# EAGLE design PowerOut_Top (EAGLE 9.3.0)
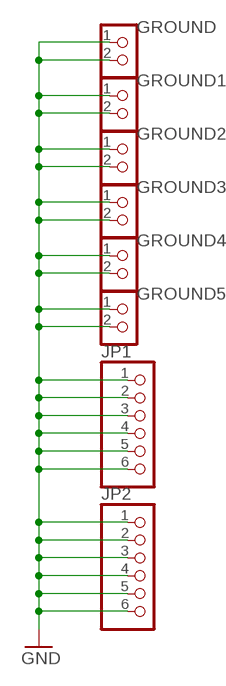
[diagram p0: schematic, sheet 1]

## Parts
GROUND  CON_TERMINAL_BLOCK_02-5MM  [TERMINAL_BLOCK_2P_5]
GROUND1  CON_TERMINAL_BLOCK_02-5MM  [TERMINAL_BLOCK_2P_5]
GROUND2  CON_TERMINAL_BLOCK_02-5MM  [TERMINAL_BLOCK_2P_5]
GROUND3  CON_TERMINAL_BLOCK_02-5MM  [TERMINAL_BLOCK_2P_5]
GROUND4  CON_TERMINAL_BLOCK_02-5MM  [TERMINAL_BLOCK_2P_5]
GROUND5  CON_TERMINAL_BLOCK_02-5MM  [TERMINAL_BLOCK_2P_5]
JP1  PINHD-1X6  [1X06]
JP2  PINHD-1X6  [1X06]

## Nets
GND [LARGE]: GROUND1.1 GROUND1.2 GROUND2.1 GROUND2.2 GROUND3.1 GROUND3.2 GROUND4.1 GROUND4.2 GROUND5.1 GROUND5.2 GROUND.1 GROUND.2 JP1.1 JP1.2 JP1.3 JP1.4 JP1.5 JP1.6 JP2.1 JP2.2 JP2.3 JP2.4 JP2.5 JP2.6

## Library data of the parts
GROUND GROUND1-GROUND5 = dp_devices:CON_TERMINAL_BLOCK_02: 2 poles wire to board terminal block
JP1 JP2 = adafruit:PINHD-1X6: PIN HEADER

## Net classes
0 default: width 0.61 mm, clearance 0.305 mm
1 LARGE: width 1.8 mm

## Board
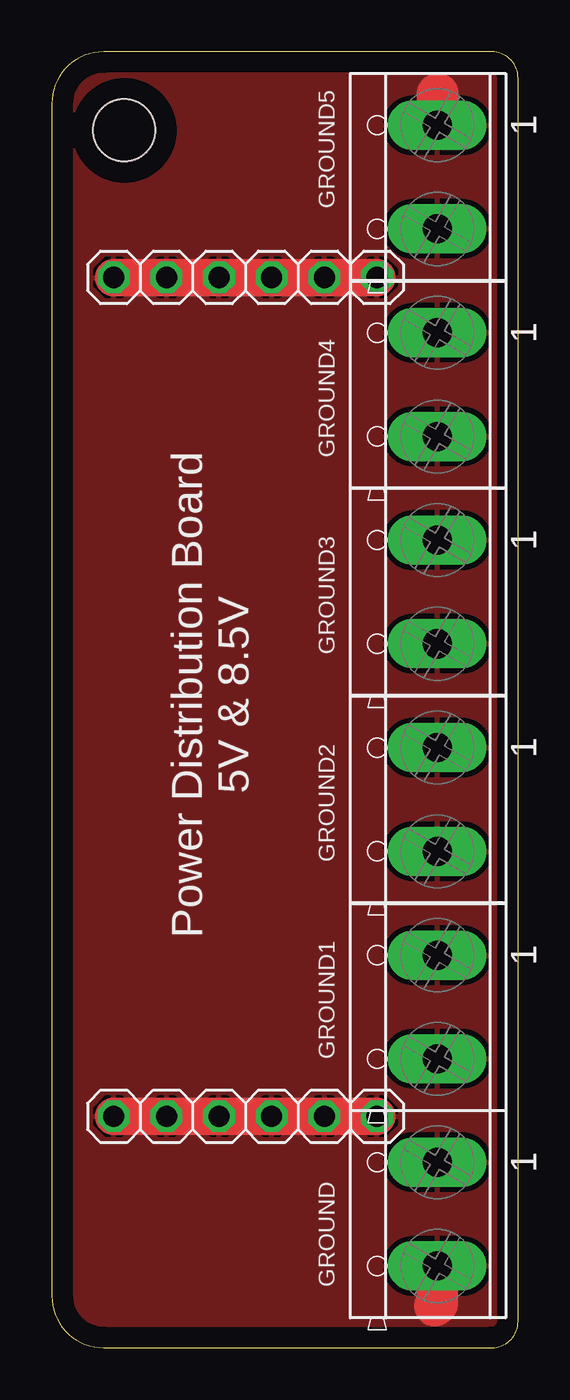
[diagram p1: board, top side]
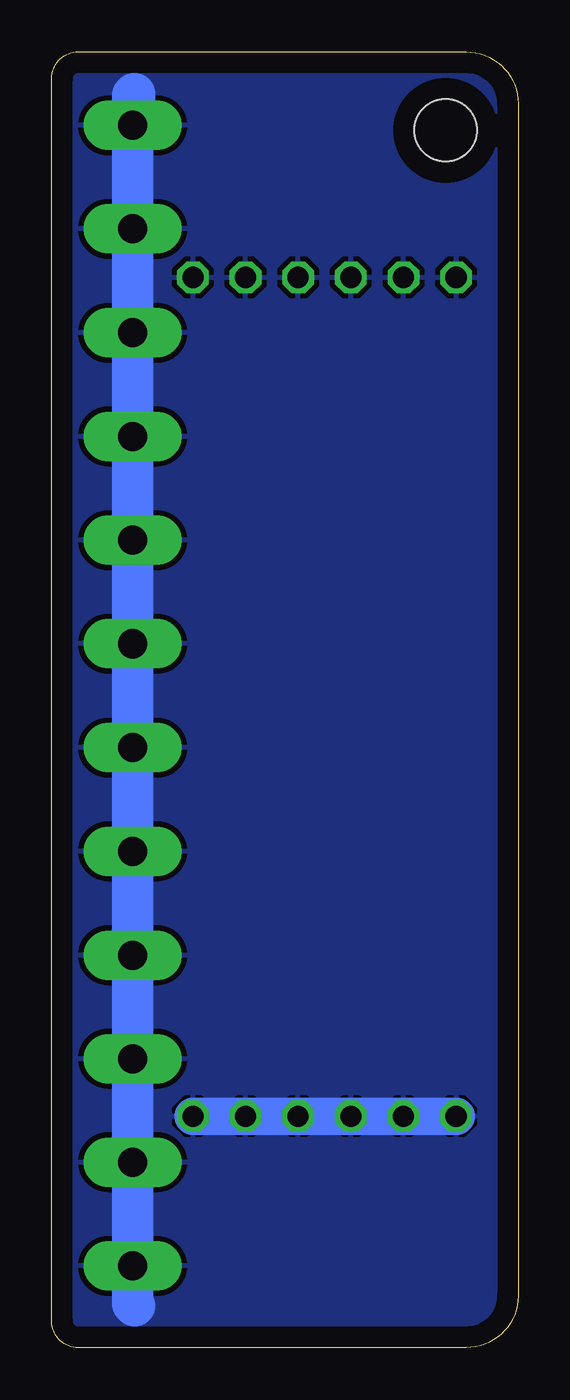
[diagram p2: board, bottom side, seen from below]

Size 22.5 x 62.5 mm. Coordinates in mm from the lower left corner, seen from the top.
Outline: 22.5,1.27 22.5,61.23 arc90 21.23,62.5 2.5,62.5 arc90 0,60 0,2.5 arc90 2.5,0 21.23,0 arc90 22.5,1.27
Copper layers (1*16): Top 0.035mm / dielectric 1.5mm / Bottom 0.035mm
Design rules "default": minimum track width 6mil, minimum drill 0.35mm, track to track 6mil, track to pad 6mil, pad to pad 6mil, via to via 6mil, smd to smd 6mil, copper to edge 40mil, drill to drill 6mil, minimum pad ring 10mil, minimum via ring 8mil, stop-mask expansion 4mil, vias tented up to drill 0mil, thermal gap 10mil
Holes 3 mm at 3.5,58.72

### Footprints (pad centres in the part's own frame; a part is rotated, then mirrored left to right if it is on the bottom)
TERMINAL_BLOCK_2P_5 = drill 1.4 pad 2.38 long: 1 2.5,-0.45; 2 -2.5,-0.45
1X06 = drill 1.016 octagon: 1 -6.35,0; 2 -3.81,0; 3 -1.27,0; 4 1.27,0; 5 3.81,0; 6 6.35,0

### Placement (x,y rotation side)
GROUND  18.15,6.44 90 top
GROUND1  18.15,16.43 90 top
GROUND2  18.15,26.44 90 top
GROUND3  18.15,36.45 90 top
GROUND4  18.15,46.45 90 top
GROUND5  18.15,56.46 90 top
JP1  9.34,11.16 0 top
JP2  9.34,51.62 0 top

### Tracks (layer width: path | path; a pad name or v marks a point on that pad's centre or on a via)
GND
  Top 1.8: JP1.6 JP1.1 | JP2.6 JP2.1
  Top 2: GROUND5.1 18.6,60.45 18.63,60.48 | GROUND.2 18.6,2.13 18.49,2.02
  Bottom 1.8: JP1.6 JP1.1
  Bottom 2: 18.5,60.48 18.52,60.48 18.6,60.4 GROUND5.1 GROUND.2 18.6,2.12 18.5,2.02 | 18.5,60.48 | 18.5,60.48 18.5,59
  pour Bottom: -0.5,-0.5 -0.5,63 23,63 23,-0.5
  pour Top: -0.5,-0.5 -0.5,63 23,63 23,-0.5

### Text on the board
tNames: Power Distribution Board / 5V & 8.5V